# Altium schematic sheet [10]_MOT_tH-BDIGDE FOC.SchDoc
size A3; DocumentNumber: 10; SheetNumber: 10; SheetTotal: 12; Ngu?i ki?m tra: bangdd; Ngu?i thi?t k?: thannt114
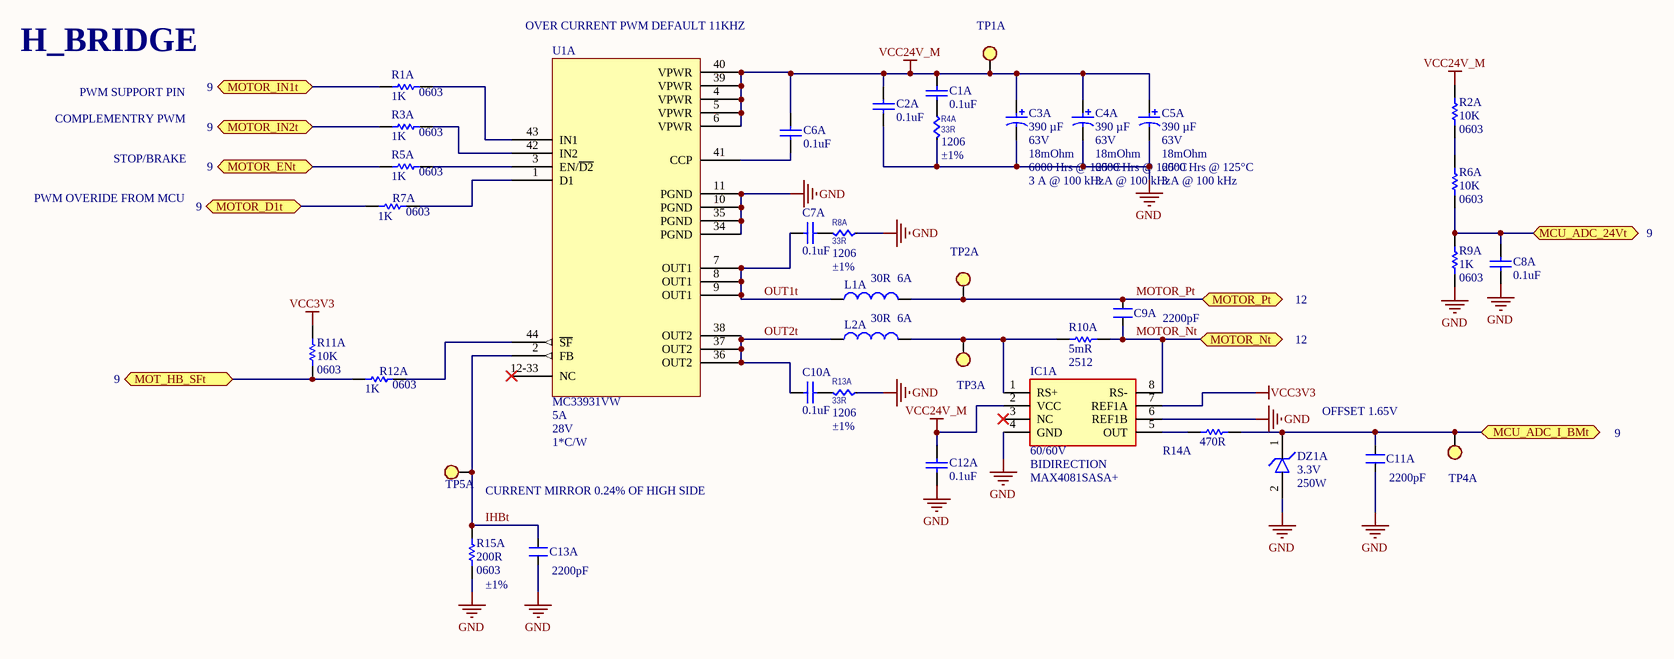
[diagram p0: [10]_MOT_tH-BDIGDE FOC.SchDoc]

## Parts
C1A  0.1uF  [CAP 0603]
C2A  0.1uF  [CAP 0603]
C3A  CPACITANCE: 390 µF  VOLTAGE: 63V  ESR: 18mOhm  Lifetime @ Temp.: 6000 Hrs @ 125°C  RIPPLE CURRENT: 3 A @ 100 kHz  [MAL218397005E3]  (hidden comment: HTK-35V391MHC5E-R2)
C4A  CPACITANCE: 390 µF  VOLTAGE: 63V  ESR: 18mOhm  Lifetime @ Temp.: 6000 Hrs @ 125°C  RIPPLE CURRENT: 3 A @ 100 kHz  [MAL218397005E3]  (hidden comment: HTK-35V391MHC5E-R2)
C5A  CPACITANCE: 390 µF  VOLTAGE: 63V  ESR: 18mOhm  Lifetime @ Temp.: 6000 Hrs @ 125°C  RIPPLE CURRENT: 3 A @ 100 kHz  [MAL218397005E3]  (hidden comment: HTK-35V391MHC5E-R2)
C6A  0.1uF  [CAP 0603]
C7A  0.1uF  [CAP 0603]
C8A  0.1uF  [CAP 0603]
C9A  2200pF  [CAP 0603]
C10A  0.1uF  [CAP 0603]
C11A  2200pF  [CAP 0603]
C12A  0.1uF  [CAP 0603]
C13A  2200pF  [CAP 0603]
DZ1A  Voltage - Reverse Standoff: 3.3V  Power - Peak Pulse: 250W  [SOD-323]  (hidden comment: ESD8351HT1G)
IC1A  GAIN: 60/60V  FUNCTION: BIDIRECTION  [8-SOIC]  (hidden comment: MAX4081SASA+)
L1A  Current: 6A  [R0805]  (hidden comment: 30R)
L2A  Current: 6A  [R0805]  (hidden comment: 30R)
R1A  PCB Footprint: 0603  [res 0603]  (hidden comment: 1K)
R2A  PCB Footprint: 0603  [res 0603]  (hidden comment: 10K)
R3A  PCB Footprint: 0603  [res 0603]  (hidden comment: 1K)
R4A  33R  PACKAGE: 1206  Tolerance: ±1%  [RES 1206]
R5A  PCB Footprint: 0603  [res 0603]  (hidden comment: 1K)
R6A  PCB Footprint: 0603  [res 0603]  (hidden comment: 10K)
R7A  PCB Footprint: 0603  [res 0603]  (hidden comment: 1K)
R8A  33R  PACKAGE: 1206  Tolerance: ±1%  [RES 1206]
R9A  PCB Footprint: 0603  [res 0603]  (hidden comment: 1K)
R10A  value 5mR  PCB Footprint: 2512  [res 2512]  (hidden comment: CRF2512-FZ-R005ELF)
R11A  PCB Footprint: 0603  [res 0603]  (hidden comment: 10K)
R12A  PCB Footprint: 0603  [res 0603]  (hidden comment: 1K)
R13A  33R  PACKAGE: 1206  Tolerance: ±1%  [RES 1206]
R14A  470R  [res 0603]
R15A  PCB Footprint: 0603  Tolerance: ±1%  [res 0603]  (hidden comment: 200R)
TP1A  TP SMD  [TESTPOINT]  (value not drawn)  (no BOM)
TP2A  TP SMD  [TESTPOINT]  (value not drawn)  (no BOM)
TP3A  TP SMD  [TESTPOINT]  (value not drawn)  (no BOM)
TP4A  TP SMD  [TESTPOINT]  (value not drawn)  (no BOM)
TP5A  TP SMD  [TESTPOINT]  (value not drawn)  (no BOM)
U1A  MC33931VW  CURRENT: 5A  MAX INPUT: 28V  THERMAL RESISTANCE: 1*C/W  [SOP44_FRE-M]

## Ports
MCU_ADC_24Vt (bidir, see 9), MCU_ADC_I_BMt (bidir, see 9), MOT_HB_SFt (bidir, see 9), MOTOR_D1t (bidir, see 9), MOTOR_ENt (bidir, see 9), MOTOR_IN1t (bidir, see 9), MOTOR_IN2t (bidir, see 9), MOTOR_Nt (bidir, see 12), MOTOR_Pt (bidir, see 12)

## Nets
GND: C2A.2 C3A.2 C4A.2 C5A.2 C8A.2 C11A.2 C12A.2 C13A.2 DZ1A.2 IC1A.4(GND) IC1A.6(REF1B) R4A.2 R8A.2 R9A.2 R13A.2 R15A.1 U1A.10(PGND) U1A.11(PGND) U1A.34(PGND) U1A.35(PGND)
VCC3V3: IC1A.7(REF1A) R11A.1
VCC24V_M: C1A.1 C2A.1 C3A.1 C4A.1 C5A.1 C6A.1 C12A.1 IC1A.2(VCC) R2A.2 TP1A.1 U1A.4(VPWR) U1A.5(VPWR) U1A.6(VPWR) U1A.39(VPWR) U1A.40(VPWR)
IHBt: C13A.1 R15A.2 TP5A.1 U1A.2(FB)
MCU_ADC_24Vt: C8A.1 R6A.1 R9A.1 ; port MCU_ADC_24Vt
MCU_ADC_I_BMt: C11A.1 DZ1A.1 R14A.2 TP4A.1 ; port MCU_ADC_I_BMt
MOT_HB_SFt: R11A.2 R12A.1 ; port MOT_HB_SFt
MOTOR_D1t: R7A.1 ; port MOTOR_D1t
MOTOR_ENt: R5A.1 ; port MOTOR_ENt
MOTOR_IN1t: R1A.1 ; port MOTOR_IN1t
MOTOR_IN2t: R3A.1 ; port MOTOR_IN2t
MOTOR_Nt: C9A.2 IC1A.8(RS-) R10A.2 ; port MOTOR_Nt
MOTOR_Pt: C9A.1 L1A.2 TP2A.1 ; port MOTOR_Pt
OUT1t: C7A.1 L1A.1 U1A.7(OUT1) U1A.8(OUT1) U1A.9(OUT1)
OUT2t: C10A.1 L2A.1 U1A.36(OUT2) U1A.37(OUT2) U1A.38(OUT2)
NetC1A_2: C1A.2 R4A.1
NetC6A_2: C6A.2 U1A.41(CCP)
NetC7A_2: C7A.2 R8A.1
NetC10A_2: C10A.2 R13A.1
NetIC1A_1: IC1A.1(RS+) L2A.2 R10A.1 TP3A.1
NetIC1A_5: IC1A.5(OUT) R14A.1
NetR1A_2: R1A.2 U1A.43(IN1)
NetR2A_1: R2A.1 R6A.2
NetR3A_2: R3A.2 U1A.42(IN2)
NetR5A_2: R5A.2 U1A.3(EN/~{D2})
NetR7A_2: R7A.2 U1A.1(D1)
NetR12A_2: R12A.2 U1A.44(~{SF})

Not connected (* = marked no-connect by the designer): IC1A 3(NC)*; U1A 12-33(NC)*

## Notes on the sheet
- H_BRIDGE
- (near U1A) OVER CURRENT PWM DEFAULT 11KHZ
- COMPLEMENTRY PWM
- PWM SUPPORT PIN
- PWM OVERIDE FROM MCU
- STOP/BRAKE
- OFFSET 1.65V
- CURRENT MIRROR 0.24% OF HIGH SIDE

## Library data of the parts
C1A C2A C6A C7A C8A C10A C12A = Cap: CAP-CER,SMD;0.1UF,10%,50V,X7R,0603; MANUFACTURER1: Samsung Electro-Mechanics; MANUFACTURER1_PART#: CL10B104KB8NNNC; MANUFACTURER2_PART#: M0603X104K050TAX; MANUFACTURER1: SS; Unit: PCS; PACKING: Tape & Reel (TR); PCB FOOTPRINT: 0603; Process Type: SM; CATEGORY: CAP-CER; VALUE: 0.1uF; FOOTPRINT: 0603; Material: X7R; Voltage: 50V; Tolerance: ±10%; MANUFACTURER2: UWA
C3A C4A C5A = CAP-ALUM,SMD;470uF,20%,12.5x30,63V,287mOhm: HYBRID ECAP, 35V, 390UF, 30G VIB; MANUFACTURER1: Elna America; Manufacturer Part Number: MAL218397005E3; Category: CAP-POLY-SMD; MANUFACTURER1_PART#: HTK-35V391MHC5E-R2; VALUE: HTK-35V391MHC5E-R2; LINK: https://www.digikey.com/en/products/detail/elna-america/HTK-35V391MHC5E-R2/10129270; PRICE: 1.732
C9A C11A C13A = CN: CAP CER 2200PF 50V X7R 0603; MANUFACTURER1: Samsung Electro-Mechanics; MANUFACTURER1_PART#: CL10B222KB8NFNC; PACKING: TR; PCB FOOTPRINT: 0603; PROCESS_TYPE: SMT; Tolerance: ±10%; Value: 2200pF; CATEGORY: CAP CER; Voltage - Rated: 50V; Temperature Coefficient: X7R
DZ1A = TVS-DIODE;BI-DIR,600W,30V/48.4V,DO214AA,SMBJ30A-E3/52: TVS DIODE 3.3VWM 11.2VC SOD323; MANUFACTURER1: onsemi; Category: TVS; MANUFACTURER1_PART#: ESD8351HT1G; VALUE: ESD8351HT1G; LINK: https://www.digikey.com/en/products/detail/onsemi/ESD8351HT1G/5257577; PRICE: 0.16
IC1A = IC; IC CURR SENSE 1 CIRCUIT,8-SOIC,-40TO 125°C,LT1999HMS8-20#PBF: IC CURR SENSE 1 CIRCUIT 8SOIC; MANUFACTURER1: Maxim; Manufacturer Part Number: MAX4081SASA+; PRICE: 3.05000; MANUFACTURER1_PART#: MAX4081SASA+; LINK: https://www.digikey.com/en/products/detail/maxim-integrated/MAX4080SASA-T/1703910; Category: IC; NI_MARK: *; VALUE: MAX4081SASA+; MANUFACTURER2: *; MANUFACTURER2_PART#: *
L1A L2A = inductor 2.2uF: FIXED IND 6.8UH 2.3A 52 MOHM SMD; MANUFACTURER1: Murata; MANUFACTURER1_PART#: BLM21SN300SH1D; PACKING: Tape & Reel (TR); PCB Footprint: 0805; Process Type: SM; Unit: PCS; Tolerance: ±20%; CORE TYPE: FERRITE; Category: Inductor; Value: 30R
R1A R3A R5A R7A R9A R12A = Res0.3: RES SMD,1K OHM,5%,1/10W,0603; MANUFACTURER1: Stackpole Electronics Inc; MANUFACTURER1_PART#: RMCF06031K00JNEAC; MANUFACTURER2_PART#: R0603J1KTG; DESCCRIPTION: RES SMD 1K OHM 5% 1/10W 0603; PACKING: Tape & Reel (TR); Process Type: SM; Unit: PCS; LOH_Code: 140100083; Power: 0.25W; Value: 1K; CATEGORY: RES SMD; MANUFACTURER2: UWA; Tolerance: ±5%
R2A R6A R11A = Res0.3: RES SMD,10K OHM 5% 1/10W 0603; MANUFACTURER1: Stackpole Electronics Inc; MANUFACTURER1_PART#: RMCF0603JT10K0; MANUFACTURER2_PART#: R0603J10KKDX; PACKING: Tape & Reel (TR); Process Type: SM; Unit: PCS; Power: 0.25W; Value: 10K; CATEGORY: RES-SMD; MANUFACTURER2: UWA; Tolerance: ±5%
R4A R8A R13A = RES 510R 1206 5%: RES 33 OHM 1% 1/4W 1206; MANUFACTURER1: Stackpole; MANUFACTURER1_PART#: RMCF1206FT33R0; PROCESS_TYPE: SMT; Power (Watts): 1/2W; Packaging: Tape and Reel; CATEGORY: RES; VALUE: 33R
R10A = Res0.3: RES 0.005 OHM 1% 2W 2512; MANUFACTURER1: Bourns; PACKING: Tape & Reel (TR); Process Type: SM; Unit: PCS; CATEGORY: RES SMD; MANUFACTURER1_PART#: CRF2512-FZ-R005ELF
R14A = Res0.3: RES SMD, 470 OHM 5% 1/8W 0603; MANUFACTURER1: KOA Speer Electronics, Inc.; MANUFACTURER1_PART#: RK73B1JTTD471J; MANUFACTURER2_PART#: RMCF0603JT470R; PACKING: Tape & Reel (TR); PCB Footprint: 0603; Process Type: SM; Unit: PCS; Power: 0.25W; Value: 470R; CATEGORY: RES SMD; MANUFACTURER2: Stackpole; Tolerance: ±5%
R15A = Res0.3: RES 200 OHM 1% 1/8W 0603; MANUFACTURER1: Stackpole Electronics Inc; MANUFACTURER1_PART#: RNCP0603FTD200R; MANUFACTURER2_PART#: RC0603FR-07200RL; DESCCRIPTION: RES SMD 1K OHM 5% 1/10W 0603; PACKING: Tape & Reel (TR); Process Type: SM; Unit: PCS; Power: 0.25W; Value: 200R; CATEGORY: RES SMD; MANUFACTURER2: YAGEO
TP1A TP2A TP3A TP4A TP5A = TP SMD: TEST POINT
U1A = MC33931VW IC MOTOR DRIVER 5V-28V 44HSOP: IC MOTOR DRIVER 5V-28V 44HSOP; MANUFACTURER1: NXP; LOH_CODE: *; MANUFACTURER1_PART#: MC33931VW; Value: MC33931VW; PRICE: 13.54000; LINK: https://www.digikey.com/en/products/detail/nxp-usa-inc/MC33931VW/2185657